# Altium schematic sheet DanSquidControlAdapterBoard.SchDoc
size Legal; PageSetup: Record=PageOptions|CenterHorizontal=True|CenterVertical=True|PrintScale=0.76|XCorrection=1.00|YCorrection=1.00|PrintKind=1|BorderSize=5000000|LeftOffset=0|BottomOffset=0|Orientation=2|PaperLength=1000|PaperWidth=1000|Scale=100|PaperSource=7|PrintQuality=-4|MediaType=1|DitherType=10|PaperKind=Letter|PrintScaleMode=1
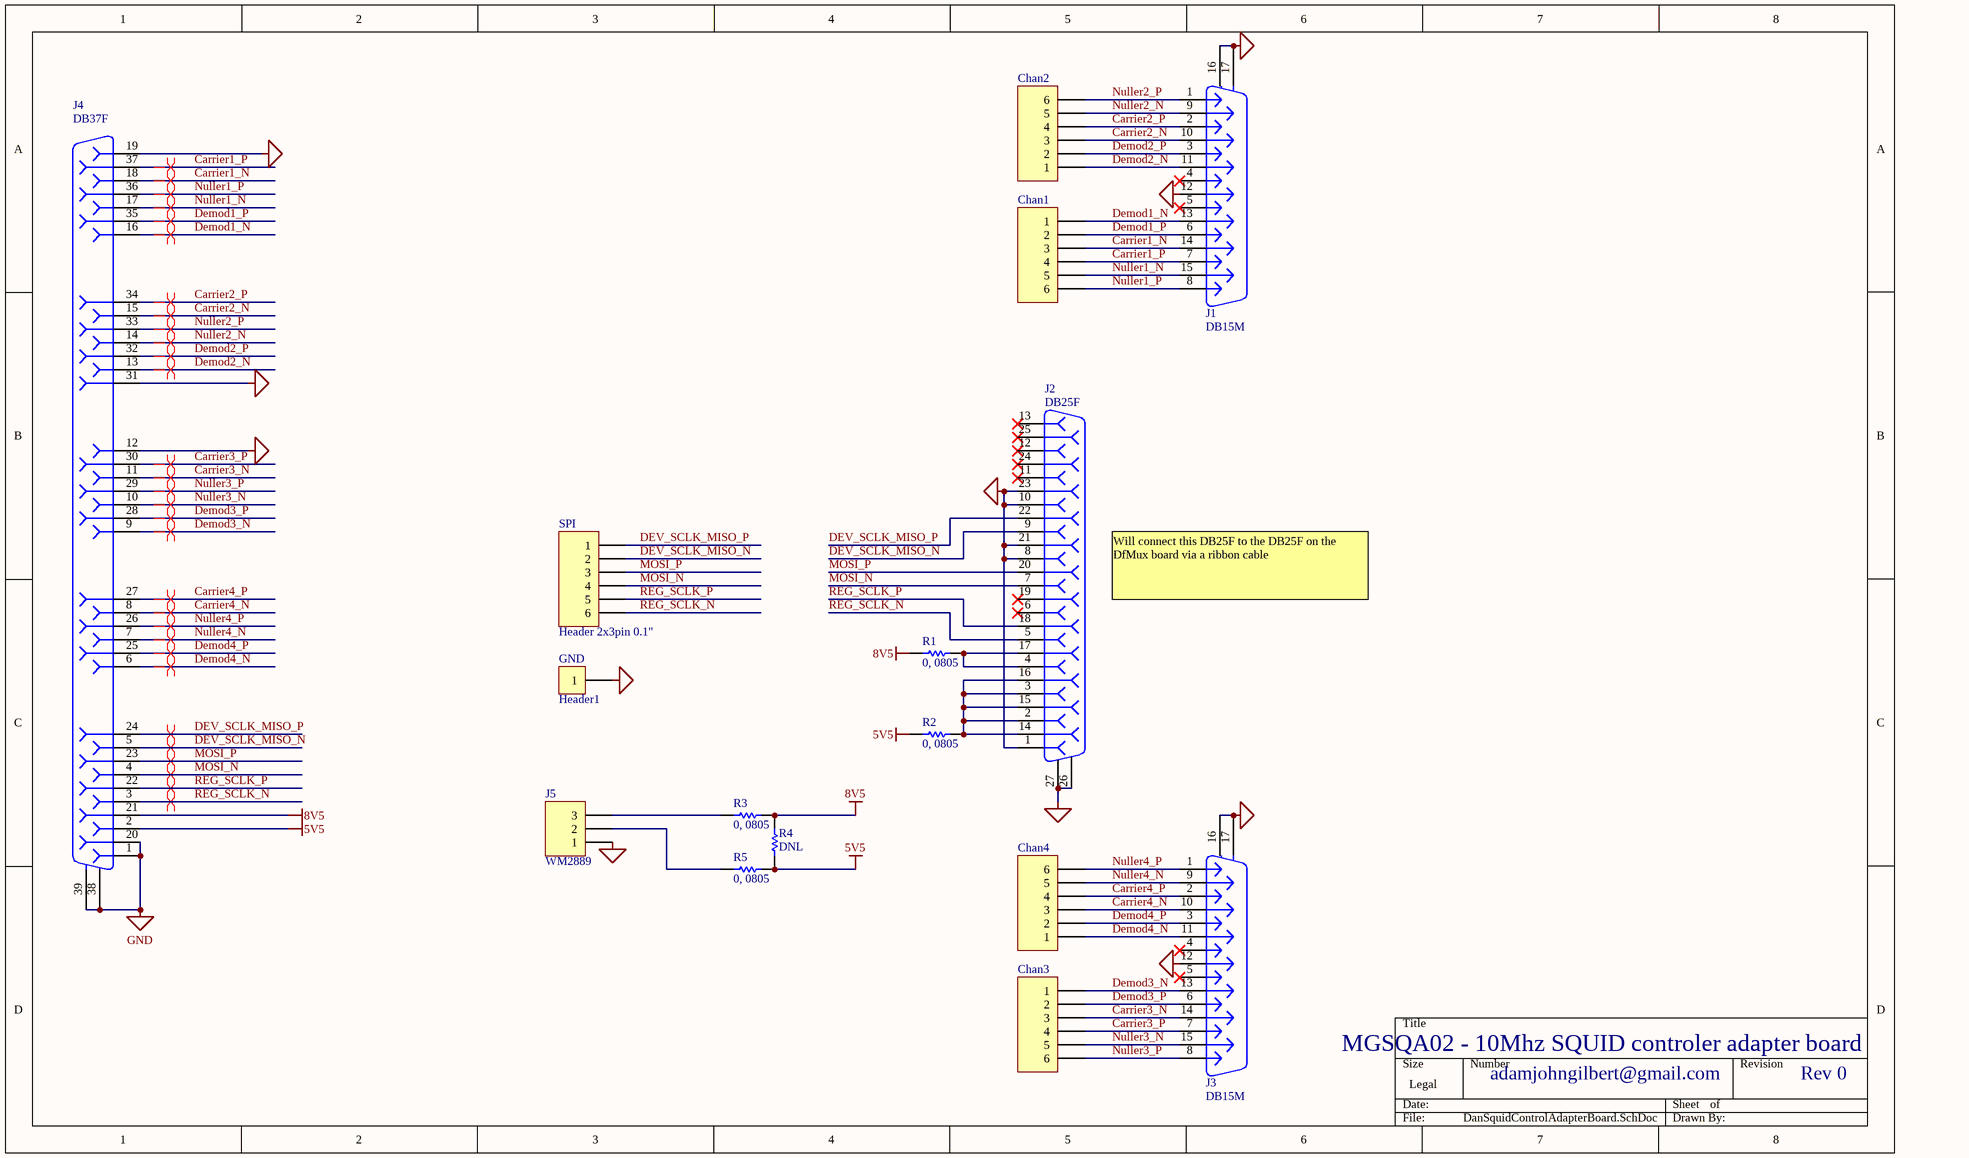
[diagram p0: DanSquidControlAdapterBoard.SchDoc]

## Parts
Chan1  Header 2x3pin 0.1"  [HDR2X3]  (value not drawn)
Chan2  Header 2x3pin 0.1"  [HDR2X3]  (value not drawn)
Chan3  Header 2x3pin 0.1"  [HDR2X3]  (value not drawn)
Chan4  Header 2x3pin 0.1"  [HDR2X3]  (value not drawn)
GND  Header1  [HDR1]
J1  DB15M  [DSUB15-M]
J2  DB25F  [DSUB25-F - Vertical]
J3  DB15M  [DSUB15-M]
J4  DB37F  [DSUB37-F]
J5  WM2889  [HDR1X3_MolexVertical]
R1  0, 0805  [0805]
R2  0, 0805  [0805]
R3  0, 0805  [0805]
R4  DNL  [0805]
R5  0, 0805  [0805]
SPI  Header 2x3pin 0.1"  [HDR2X3]

## Nets
5V5: J4.2 R2.1 R4.1 R5.2
8V5: J4.21 R1.1 R3.2 R4.2
GND: GND.1 J1.12 J1.16(MH1) J1.17(MH2) J2.1 J2.8 J2.10 J2.21 J2.23 J2.26(MH1) J2.27(MH2) J3.12 J3.16(MH1) J3.17(MH2) J4.1 J4.12 J4.19 J4.20 J4.31 J4.38(MH1) J4.39(MH2) J5.1
Carrier1_N: Chan1.3 J1.14 J4.18
Carrier1_P: Chan1.4 J1.7 J4.37
Carrier2_N: Chan2.3 J1.10 J4.15
Carrier2_P: Chan2.4 J1.2 J4.34
Carrier3_N: Chan3.3 J3.14 J4.11
Carrier3_P: Chan3.4 J3.7 J4.30
Carrier4_N: Chan4.3 J3.10 J4.8
Carrier4_P: Chan4.4 J3.2 J4.27
Demod1_N: Chan1.1 J1.13 J4.16
Demod1_P: Chan1.2 J1.6 J4.35
Demod2_N: Chan2.1 J1.11 J4.13
Demod2_P: Chan2.2 J1.3 J4.32
Demod3_N: Chan3.1 J3.13 J4.9
Demod3_P: Chan3.2 J3.6 J4.28
Demod4_N: Chan4.1 J3.11 J4.6
Demod4_P: Chan4.2 J3.3 J4.25
DEV_SCLK_MISO_N: J2.9 J4.5 SPI.2
DEV_SCLK_MISO_P: J2.22 J4.24 SPI.1
MOSI_N: J2.7 J4.4 SPI.4
MOSI_P: J2.20 J4.23 SPI.3
Nuller1_N: Chan1.5 J1.15 J4.17
Nuller1_P: Chan1.6 J1.8 J4.36
Nuller2_N: Chan2.5 J1.9 J4.14
Nuller2_P: Chan2.6 J1.1 J4.33
Nuller3_N: Chan3.5 J3.15 J4.10
Nuller3_P: Chan3.6 J3.8 J4.29
Nuller4_N: Chan4.5 J3.9 J4.7
Nuller4_P: Chan4.6 J3.1 J4.26
REG_SCLK_N: J2.5 J4.3 SPI.6
REG_SCLK_P: J2.18 J4.22 SPI.5
NetJ2_2: J2.2 J2.3 J2.14 J2.15 J2.16 R2.2
NetJ2_4: J2.4 J2.17 R1.2
NetJ5_2: J5.2 R5.1
NetJ5_3: J5.3 R3.1

Not connected (* = marked no-connect by the designer): J1 4* 5*; J2 6* 11* 12* 13* 19* 24* 25*; J3 4* 5*

## Layout directives
differential pair: Carrier1_N, Carrier1_P, Carrier2_N, Carrier2_P, Carrier3_N, Carrier3_P, Carrier4_N, Carrier4_P, Demod1_N, Demod1_P, Demod2_N, Demod2_P, Demod3_N, Demod3_P, Demod4_N, Demod4_P, DEV_SCLK_MISO_N, DEV_SCLK_MISO_P, MOSI_N, MOSI_P, Nuller1_N, Nuller1_P, Nuller2_N, Nuller2_P, Nuller3_N, Nuller3_P, Nuller4_N, Nuller4_P, REG_SCLK_N, REG_SCLK_P

## Notes on the sheet
- (near J2) Will connect this DB25F to the DB25F on the DfMux board via a ribbon cable
- MGSQA02 - 10Mhz SQUID controler adapter board
- adamjohngilbert@gmail.com
- Rev 0

## Library data of the parts
Chan1-Chan4 SPI = Header2x3
GND = Header1: TestPoint1; Footprint: *; Techinf: *
J4 = DB37F: Manufacturer: Generic; Symbol status: Proto; Manufacturer Part Number: DB37F
J5 = Header 3: Header, 0.1"  3-Pin straight (Any equivalent - may need to be value added); Manufacturer: Digikey; Manufacturers P/N: A26508-03-ND
R1-R3 R5 = RES 0805: RES 0.0 OHM 1/8W 0805 SMD; Manufacturers P/N: e.g CRCW08050000Z0EAHP; Manufacturer: e.g Vishay/Dale; Part constraints: 0Ohm jumper, >=4A, 0805, <=5mOhms; Param1: 200ppm/C; Value: DNL; CanPurchaseFrom: Newark; Param: 1%
R4 = RES 0805: RES 0.0 OHM 1/8W 0805 SMD; Manufacturers P/N: e.g CRCW08050000Z0EAHP; Manufacturer: e.g Vishay/Dale; Part constraints: 0Ohm jumper, >=4A, 0805, <=5mOhms; Param1: 200ppm/C; CanPurchaseFrom: Newark; Param: 1%; Value: DNL